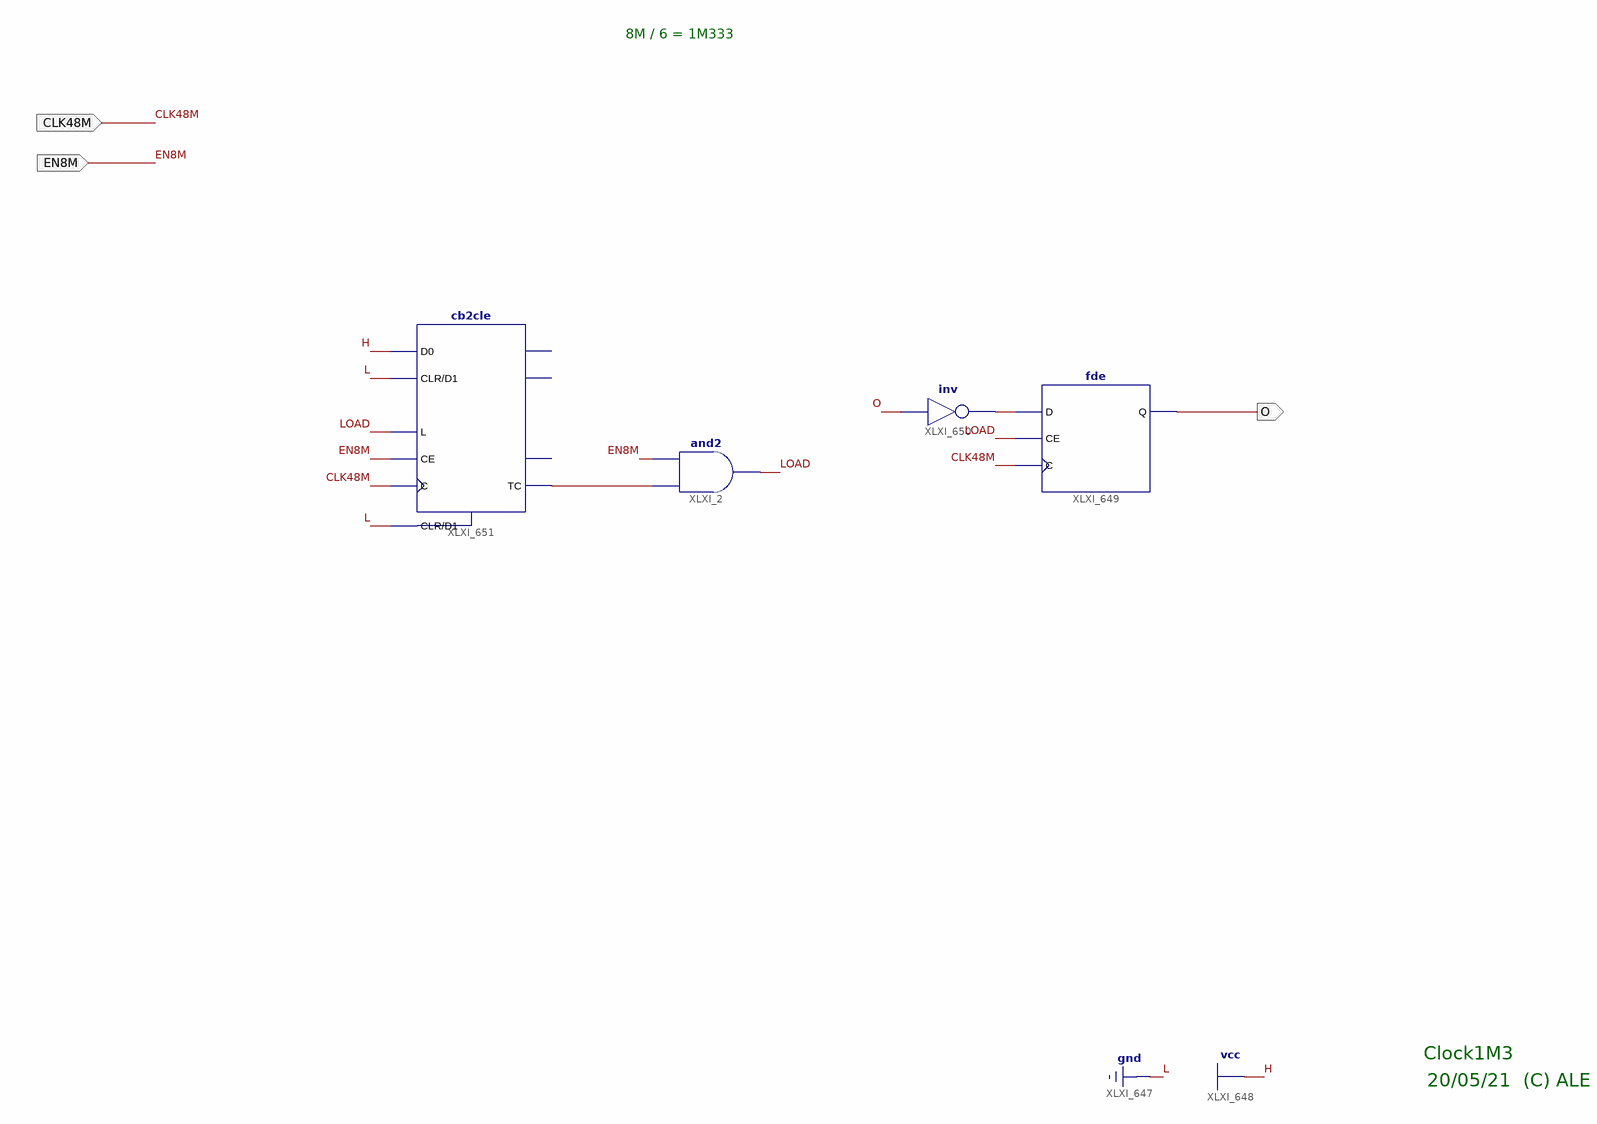
[diagram p0: schematic sheet 1]
// Xilinx ISE schematic Clock1M3.sch (spartan3e) as structural Verilog: 4 symbols, 3 ports
module Clock1M3 (
  input  CLK48M,
  input  EN8M,
  output O
);

  wire LOAD, XLXN_10, XLXN_17;

  and XLXI_2 (LOAD, XLXN_10, EN8M);
  fde XLXI_649 (.C(CLK48M), .CE(LOAD), .D(XLXN_17), .Q(O));
  not XLXI_650 (XLXN_17, O);
  cb2cle XLXI_651 (
    .C(CLK48M), .CE(EN8M), .CLR(1'b0), .D0(1'b1), .D1(1'b0), .L(LOAD), .TC(XLXN_10));  // open: CEO, Q0, Q1

  // Notes on the sheet:
  //   8M / 6 = 1M333
  //   Clock1M3
  //   20/05/21  (C) ALE
endmodule
